# Altium schematic sheet S3_Connectors.SchDoc: Connectors
size Tabloid; DrawnBy: Dhrumil Parikh; SheetNumber: 3; SheetTotal: 6; PageSetup: Record=PageOptions|CenterHorizontal=True|CenterVertical=True|PrintScale=0.62|XCorrection=1.00|YCorrection=1.00|PrintKind=1|BorderSize=5000000|LeftOffset=0|BottomOffset=0|Orientation=2|PaperLength=1000|PaperWidth=1000|Scale=100|PaperSource=7|PrintQuality=600|MediaType=1|DitherType=10|PaperKind=Letter|PrintScaleMode=1; PageSize: T
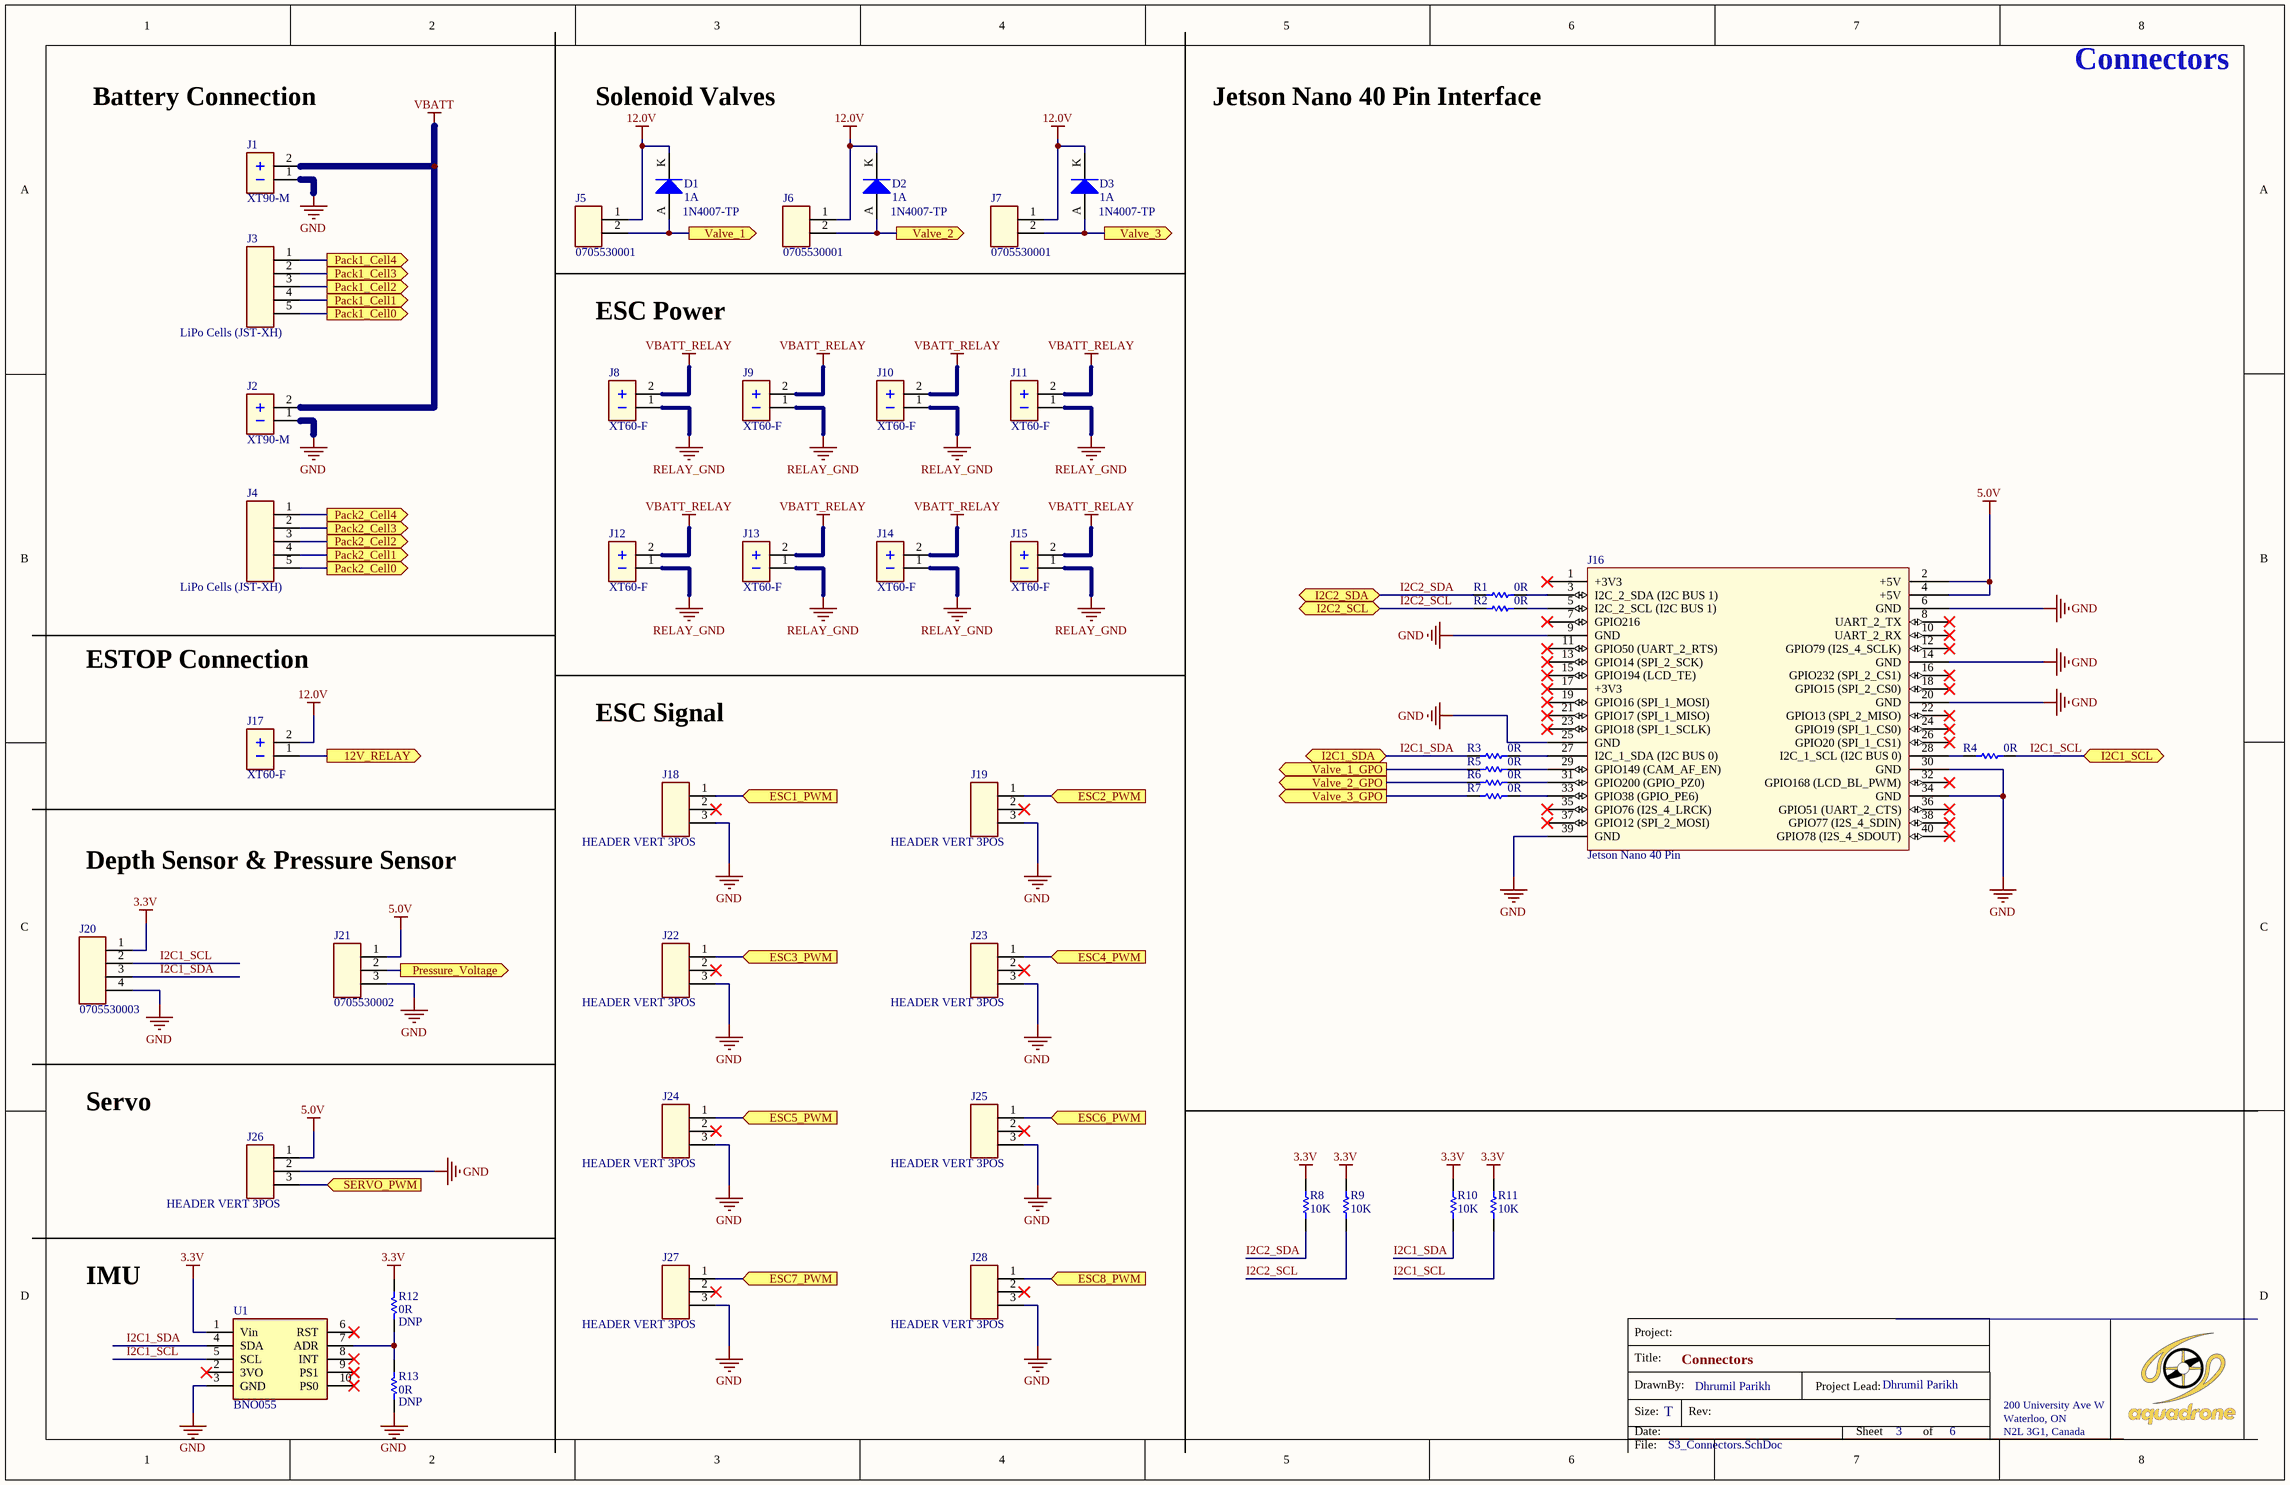
[diagram p0: S3_Connectors.SchDoc]

## Parts
D1  value 1N4007-TP  CURRENT: 1A  [DIOAD1405W90L465D235]  (hidden comment: DIODE GEN PURP 1KV 1A DO41)
D2  value 1N4007-TP  CURRENT: 1A  [DIOAD1405W90L465D235]  (hidden comment: DIODE GEN PURP 1KV 1A DO41)
D3  value 1N4007-TP  CURRENT: 1A  [DIOAD1405W90L465D235]  (hidden comment: DIODE GEN PURP 1KV 1A DO41)
J1  value XT90-M  [XT90]  (hidden comment: CONN XT90 MALE)
J2  value XT90-M  [XT90]  (hidden comment: CONN XT90 MALE)
J3  value LiPo Cells (JST-XH)  [SHDR5W64P0X250_1X5_1490X1150X610P]  (hidden comment: CONN HEADER R/A 5POS 2.5MM)
J4  value LiPo Cells (JST-XH)  [SHDR5W64P0X250_1X5_1490X1150X610P]  (hidden comment: CONN HEADER R/A 5POS 2.5MM)
J5  value 0705530001  [SHDRRA2W109P0_254_1X2_762X1359X699P]  (hidden comment: CONN HEADER R/A 2POS 2.54MM)
J6  value 0705530001  [SHDRRA2W109P0_254_1X2_762X1359X699P]  (hidden comment: CONN HEADER R/A 2POS 2.54MM)
J7  value 0705530001  [SHDRRA2W109P0_254_1X2_762X1359X699P]  (hidden comment: CONN HEADER R/A 2POS 2.54MM)
J8  value XT60-F  [XT60]  (hidden comment: CONN XT60 FEMALE)
J9  value XT60-F  [XT60]  (hidden comment: CONN XT60 FEMALE)
J10  value XT60-F  [XT60]  (hidden comment: CONN XT60 FEMALE)
J11  value XT60-F  [XT60]  (hidden comment: CONN XT60 FEMALE)
J12  value XT60-F  [XT60]  (hidden comment: CONN XT60 FEMALE)
J13  value XT60-F  [XT60]  (hidden comment: CONN XT60 FEMALE)
J14  value XT60-F  [XT60]  (hidden comment: CONN XT60 FEMALE)
J15  value XT60-F  [XT60]  (hidden comment: CONN XT60 FEMALE)
J16  value Jetson Nano 40 Pin  [Jetson Nano]  (hidden comment: Jetson Nano 40 Pin Interface)
J17  value XT60-F  [XT60]  (hidden comment: CONN XT60 FEMALE)
J18  value HEADER VERT 3POS  [61300311121]  (hidden comment: CONN HEADER VERT 3POS 2.54MM)
J19  value HEADER VERT 3POS  [61300311121]  (hidden comment: CONN HEADER VERT 3POS 2.54MM)
J20  value 0705530003  [SHDR4W97P0X254_1X4_1271X1359X699P]  (hidden comment: CONN HEADER R/A 4POS 2.54MM)
J21  value 0705530002  [SHDR3W89P0X254_1X3_1017X1359X699P]  (hidden comment: CONN HEADER R/A 3POS 2.54MM)
J22  value HEADER VERT 3POS  [61300311121]  (hidden comment: CONN HEADER VERT 3POS 2.54MM)
J23  value HEADER VERT 3POS  [61300311121]  (hidden comment: CONN HEADER VERT 3POS 2.54MM)
J24  value HEADER VERT 3POS  [61300311121]  (hidden comment: CONN HEADER VERT 3POS 2.54MM)
J25  value HEADER VERT 3POS  [61300311121]  (hidden comment: CONN HEADER VERT 3POS 2.54MM)
J26  value HEADER VERT 3POS  [61300311121]  (hidden comment: CONN HEADER VERT 3POS 2.54MM)
J27  value HEADER VERT 3POS  [61300311121]  (hidden comment: CONN HEADER VERT 3POS 2.54MM)
J28  value HEADER VERT 3POS  [61300311121]  (hidden comment: CONN HEADER VERT 3POS 2.54MM)
R1  value 0R  [RESC2012X07N]  (hidden comment: RES SMD 0 OHM JUMPER 1/8W 0805)
R2  value 0R  [RESC2012X07N]  (hidden comment: RES SMD 0 OHM JUMPER 1/8W 0805)
R3  value 0R  [RESC2012X07N]  (hidden comment: RES SMD 0 OHM JUMPER 1/8W 0805)
R4  value 0R  [RESC2012X07N]  (hidden comment: RES SMD 0 OHM JUMPER 1/8W 0805)
R5  value 0R  [RESC2012X07N]  (hidden comment: RES SMD 0 OHM JUMPER 1/8W 0805)
R6  value 0R  [RESC2012X07N]  (hidden comment: RES SMD 0 OHM JUMPER 1/8W 0805)
R7  value 0R  [RESC2012X07N]  (hidden comment: RES SMD 0 OHM JUMPER 1/8W 0805)
R8  value 10K  [RESC1608X06N]  (hidden comment: RES SMD 10K OHM 1% 1/10W 0603)
R9  value 10K  [RESC1608X06N]  (hidden comment: RES SMD 10K OHM 1% 1/10W 0603)
R10  value 10K  [RESC1608X06N]  (hidden comment: RES SMD 10K OHM 1% 1/10W 0603)
R11  value 10K  [RESC1608X06N]  (hidden comment: RES SMD 10K OHM 1% 1/10W 0603)
R12  value 0R  NOSTUFF: DNP  [RESC2012X07N]  (hidden comment: RES SMD 0 OHM JUMPER 1/8W 0805)
R13  value 0R  NOSTUFF: DNP  [RESC2012X07N]  (hidden comment: RES SMD 0 OHM JUMPER 1/8W 0805)
U1  IC BNO055  [BNO055]  (value not drawn)

## Ports
12V_RELAY (out), ESC1_PWM (in), ESC2_PWM (in), ESC3_PWM (in), ESC4_PWM (in), ESC5_PWM (in), ESC6_PWM (in), ESC7_PWM (in), ESC8_PWM (in), I2C1_SCL (bidir), I2C1_SDA (bidir), I2C2_SCL (bidir), I2C2_SDA (bidir), Pack1_Cell0 (out), Pack1_Cell1 (out), Pack1_Cell2 (out), Pack1_Cell3 (out), Pack1_Cell4 (out), Pack2_Cell0 (out), Pack2_Cell1 (out), Pack2_Cell2 (out), Pack2_Cell3 (out), Pack2_Cell4 (out), Pressure_Voltage (out), SERVO_PWM (in), Valve_1 (out), Valve_1_GPO (out), Valve_2 (out), Valve_2_GPO (out), Valve_3 (out), Valve_3_GPO (out)

## Nets
3.3V: J20.1 R8.2 R9.2 R10.2 R11.2 R12.1 U1.1(Vin)
5.0V: J16.2(+5V) J16.4(+5V) J21.1 J26.1
12.0V: D1.K D2.K D3.K J5.1 J6.1 J7.1 J17.2
GND: J1.1 J2.1 J16.6(GND) J16.9(GND) J16.14(GND) J16.20(GND) J16.25(GND) J16.30(GND) J16.34(GND) J16.39(GND) J18.3 J19.3 J20.4 J21.3 J22.3 J23.3 J24.3 J25.3 J26.2 J27.3 J28.3 R13.2 U1.3(GND)
RELAY_GND: J8.1 J9.1 J10.1 J11.1 J12.1 J13.1 J14.1 J15.1
VBATT: J1.2 J2.2
VBATT_RELAY: J8.2 J9.2 J10.2 J11.2 J12.2 J13.2 J14.2 J15.2
12V_RELAY: J17.1 ; port 12V_RELAY
ESC1_PWM: J18.1 ; port ESC1_PWM
ESC2_PWM: J19.1 ; port ESC2_PWM
ESC3_PWM: J22.1 ; port ESC3_PWM
ESC4_PWM: J23.1 ; port ESC4_PWM
ESC5_PWM: J24.1 ; port ESC5_PWM
ESC6_PWM: J25.1 ; port ESC6_PWM
ESC7_PWM: J27.1 ; port ESC7_PWM
ESC8_PWM: J28.1 ; port ESC8_PWM
I2C1_SCL: J20.2 R4.2 R11.1 U1.5(SCL) ; port I2C1_SCL
I2C1_SDA: J20.3 R3.1 R10.1 U1.4(SDA) ; port I2C1_SDA
I2C2_SCL: R2.1 R9.1 ; port I2C2_SCL
I2C2_SDA: R1.1 R8.1 ; port I2C2_SDA
Pack1_Cell0: J3.5 ; port Pack1_Cell0
Pack1_Cell1: J3.4 ; port Pack1_Cell1
Pack1_Cell2: J3.3 ; port Pack1_Cell2
Pack1_Cell3: J3.2 ; port Pack1_Cell3
Pack1_Cell4: J3.1 ; port Pack1_Cell4
Pack2_Cell0: J4.5 ; port Pack2_Cell0
Pack2_Cell1: J4.4 ; port Pack2_Cell1
Pack2_Cell2: J4.3 ; port Pack2_Cell2
Pack2_Cell3: J4.2 ; port Pack2_Cell3
Pack2_Cell4: J4.1 ; port Pack2_Cell4
Pressure_Voltage: J21.2 ; port Pressure_Voltage
SERVO_PWM: J26.3 ; port SERVO_PWM
Valve_1: D1.A J5.2 ; port Valve_1
Valve_1_GPO: R5.1 ; port Valve_1_GPO
Valve_2: D2.A J6.2 ; port Valve_2
Valve_2_GPO: R6.1 ; port Valve_2_GPO
Valve_3: D3.A J7.2 ; port Valve_3
Valve_3_GPO: R7.1 ; port Valve_3_GPO
NetJ16_3: J16.3(I2C_2_SDA_(I2C_BUS_1)) R1.2
NetJ16_5: J16.5(I2C_2_SCL_(I2C_BUS_1)) R2.2
NetJ16_27: J16.27(I2C_1_SDA_(I2C_BUS_0)) R3.2
NetJ16_28: J16.28(I2C_1_SCL_(I2C_BUS_0)) R4.1
NetJ16_29: J16.29(GPIO149_(CAM_AF_EN)) R5.2
NetJ16_31: J16.31(GPIO200_(GPIO_PZ0)) R6.2
NetJ16_33: J16.33(GPIO38_(GPIO_PE6)) R7.2
NetR12_2: R12.2 R13.1 U1.7(ADR)

Not connected (* = marked no-connect by the designer): J16 1(+3V3)* 7(GPIO216)* 8(UART_2_TX)* 10(UART_2_RX)* 11(GPIO50_(UART_2_RTS))* 12(GPIO79_(I2S_4_SCLK))* 13(GPIO14_(SPI_2_SCK))* 15(GPIO194_(LCD_TE))* 16(GPIO232_(SPI_2_CS1))* 17(+3V3)* 18(GPIO15_(SPI_2_CS0))* 19(GPIO16_(SPI_1_MOSI))* 21(GPIO17_(SPI_1_MISO))* 22(GPIO13_(SPI_2_MISO))* 23(GPIO18_(SPI_1_SCLK))* 24(GPIO19_(SPI_1_CS0))* 26(GPIO20_(SPI_1_CS1))* 32(GPIO168_(LCD_BL_PWM))* 35(GPIO76_(I2S_4_LRCK))* 36(GPIO51_(UART_2_CTS))* 37(GPIO12_(SPI_2_MOSI))* 38(GPIO77_(I2S_4_SDIN))* 40(GPIO78_(I2S_4_SDOUT))*; J18 2*; J19 2*; J22 2*; J23 2*; J24 2*; J25 2*; J27 2*; J28 2*; U1 2(3VO)* 6(RST)* 8(INT)* 9(PS1)* 10(PS0)*

## Notes on the sheet
- Battery Connection
- Solenoid Valves
- Jetson Nano 40 Pin Interface
- ESC Power
- ESTOP Connection
- ESC Signal
- Depth Sensor & Pressure Sensor
- Servo
- IMU
- Title:
- Project:
- Size:
- Date:
- DrawnBy:
- Rev:
- Project Lead:
- Sheet
- Dhrumil Parikh
- of
- 200 University Ave W
- Waterloo, ON
- N2L 3G1, Canada
- File:

## Library data of the parts
D1-D3 = DIODE GEN PURP 1KV 1A DO41: MFG: Micro Commercial Co; VR: 1000V; COST: 0.14; MFG_PART_NO: 1N4007-TP
J1 J2 = CONN XT90 MALE: MFG_PART_NO: FIT0588; MFG: DFRobot; COST: 5.66000
J3 J4 = CONN HEADER R/A 5POS 2.5MM: MFG_PART_NO: S5B-XH-A(LF)(SN); MFG: JST Sales America Inc.; COST: 0.43
J5-J7 = CONN HEADER R/A 2POS 2.54MM: MFG: Molex; COST: 1.12; MFG_PART_NO: 0705530001
J8-J15 J17 = CONN XT60 FEMALE: MFG_PART_NO: FIT0587; MFG: DFRobot; COST: 2.18
J18 J19 J22-J28 = CONN HEADER VERT 3POS 2.54MM: MFG: Wurth Electronics Inc.; COST: 0.18; MFG_PART_NO: 61300311121
J20 = CONN HEADER R/A 4POS 2.54MM: MFG: Molex; COST: 1.51; MFG_PART_NO: 0705530003
J21 = CONN HEADER R/A 3POS 2.54MM: MFG: Molex; COST: 1.47; MFG_PART_NO: 0705530002
R1-R7 R12 R13 = RES SMD 0 OHM JUMPER 1/8W 0805: MFG_PART_NO: ERJ-6GEY0R00V; MFG: Panasonic; COST: 0.15
R8-R11 = RES SMD 10K OHM 1% 1/10W 0603: MFG_PART_NO: CRCW060310K0FKEA; MFG: Vishay Dale; COST: 0.15; TOLERANCE: 1%
U1 = IC BNO055: MFG: Adafruit Industries LLC; COST: 50; VALUE: BNO055; MFG_PART_NO: BNO055
J16 = Jetson Nano 40 Pin Interface: COST: 60; MFG: Jetson; MFG_PART_NO: Nano